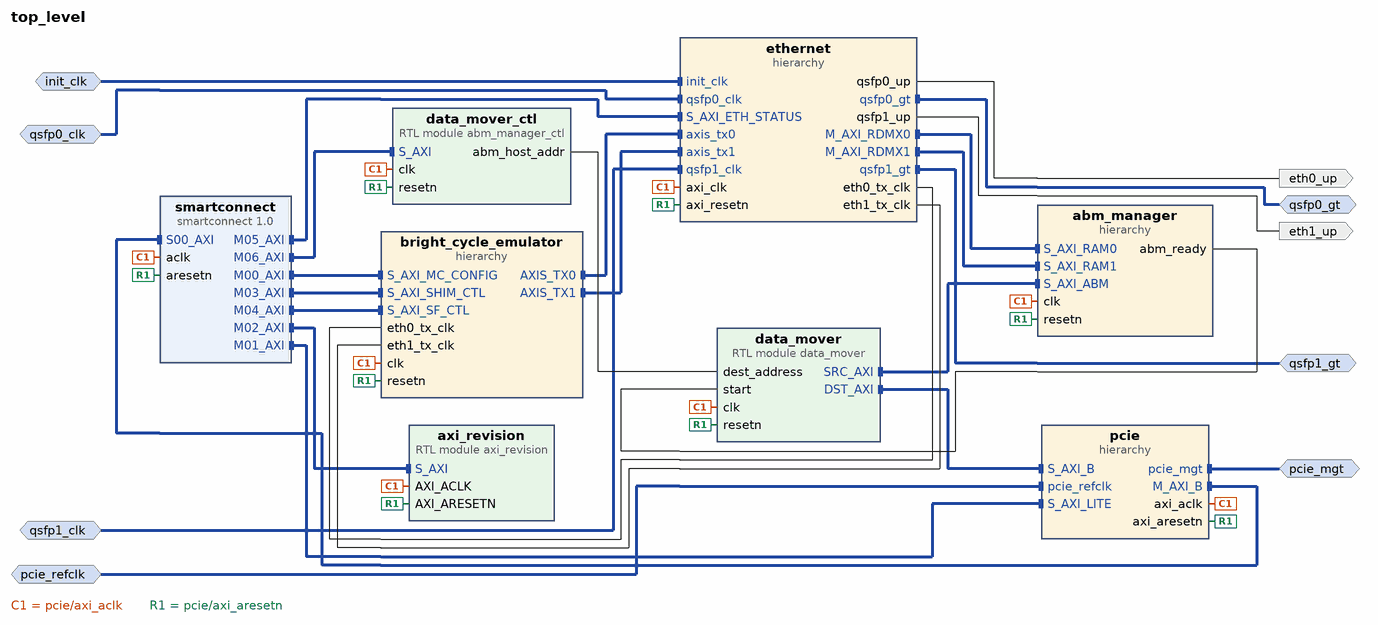
[diagram p0: block diagram of the top level]
# Vivado block design top_level, xczu19eg-ffvc1760-2-i, Vivado 2021.1
create_bd_design top_level

create_bd_intf_port -mode Slave -vlnv xilinx.com:interface:diff_clock_rtl:1.0 pcie_refclk
create_bd_intf_port -mode Master -vlnv xilinx.com:interface:pcie_7x_mgt_rtl:1.0 pcie_mgt
create_bd_intf_port -mode Slave -vlnv xilinx.com:interface:diff_clock_rtl:1.0 qsfp0_clk
set_property -dict {CONFIG.FREQ_HZ 322265625} [get_bd_intf_ports qsfp0_clk]
create_bd_intf_port -mode Master -vlnv xilinx.com:interface:gt_rtl:1.0 qsfp0_gt
create_bd_intf_port -mode Master -vlnv xilinx.com:interface:gt_rtl:1.0 qsfp1_gt
create_bd_intf_port -mode Slave -vlnv xilinx.com:interface:diff_clock_rtl:1.0 qsfp1_clk
set_property -dict {CONFIG.FREQ_HZ 322265625} [get_bd_intf_ports qsfp1_clk]
create_bd_intf_port -mode Slave -vlnv xilinx.com:interface:diff_clock_rtl:1.0 init_clk
create_bd_port -dir O eth0_up
create_bd_port -dir O eth1_up

create_bd_cell -type hier pcie
create_bd_cell -type hier bright_cycle_emulator
create_bd_cell -type hier ethernet
create_bd_cell -type hier abm_manager
create_bd_cell -type module -reference abm_manager_ctl data_mover_ctl
create_bd_cell -type module -reference data_mover data_mover
create_bd_cell -type ip -vlnv xilinx.com:ip:smartconnect:1.0 smartconnect
set_property -dict {CONFIG.NUM_CLKS 1 CONFIG.NUM_MI 7 CONFIG.NUM_SI 2} [get_bd_cells smartconnect]
create_bd_cell -type module -reference axi_revision axi_revision

# ---- hierarchy /pcie ----
current_bd_instance /pcie
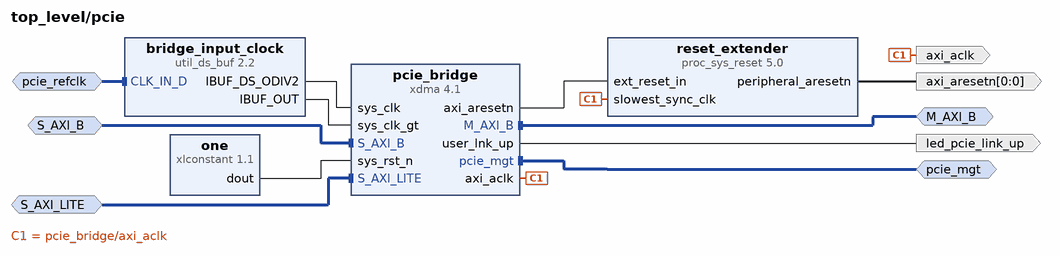
[diagram p1: block diagram inside /pcie]
create_bd_intf_pin -mode Master -vlnv xilinx.com:interface:aximm_rtl:1.0 M_AXI_B
create_bd_intf_pin -mode Slave -vlnv xilinx.com:interface:aximm_rtl:1.0 S_AXI_LITE
create_bd_intf_pin -mode Master -vlnv xilinx.com:interface:pcie_7x_mgt_rtl:1.0 pcie_mgt
create_bd_intf_pin -mode Slave -vlnv xilinx.com:interface:diff_clock_rtl:1.0 pcie_refclk
create_bd_intf_pin -mode Slave -vlnv xilinx.com:interface:aximm_rtl:1.0 S_AXI_B
create_bd_pin -dir O led_pcie_link_up
create_bd_pin -dir O -type clk axi_aclk
create_bd_pin -dir O -from 0 -to 0 -type rst axi_aresetn

create_bd_cell -type ip -vlnv xilinx.com:ip:proc_sys_reset:5.0 reset_extender
create_bd_cell -type ip -vlnv xilinx.com:ip:util_ds_buf:2.2 bridge_input_clock
set_property -dict {CONFIG.C_BUF_TYPE IBUFDSGTE} [get_bd_cells bridge_input_clock]
create_bd_cell -type ip -vlnv xilinx.com:ip:xdma:4.1 pcie_bridge
set_property -dict [list \
  CONFIG.PF0_DEVICE_ID_mqdma 903F \
  CONFIG.PF0_SRIOV_VF_DEVICE_ID A03F \
  CONFIG.PF2_DEVICE_ID_mqdma 923F \
  CONFIG.PF3_DEVICE_ID_mqdma 933F \
  CONFIG.axi_addr_width 64 \
  CONFIG.axi_data_width 512_bit \
  CONFIG.axisten_freq 250 \
  CONFIG.bridge_burst true \
  CONFIG.dma_reset_source_sel User_Reset \
  CONFIG.en_axi_slave_if true \
  CONFIG.enable_jtag_dbg false \
  CONFIG.functional_mode AXI_Bridge \
  CONFIG.mode_selection Advanced \
  CONFIG.pcie_blk_locn X1Y0 \
  CONFIG.pf0_bar0_scale Megabytes \
  CONFIG.pf0_bar0_size 1 \
  CONFIG.pf0_device_id 903F \
  CONFIG.pl_link_cap_max_link_speed 8.0_GT/s \
  CONFIG.pl_link_cap_max_link_width X16 \
  CONFIG.plltype QPLL1 \
] [get_bd_cells pcie_bridge]
create_bd_cell -type ip -vlnv xilinx.com:ip:xlconstant:1.1 one

# ---- hierarchy /bright_cycle_emulator ----
current_bd_instance /bright_cycle_emulator
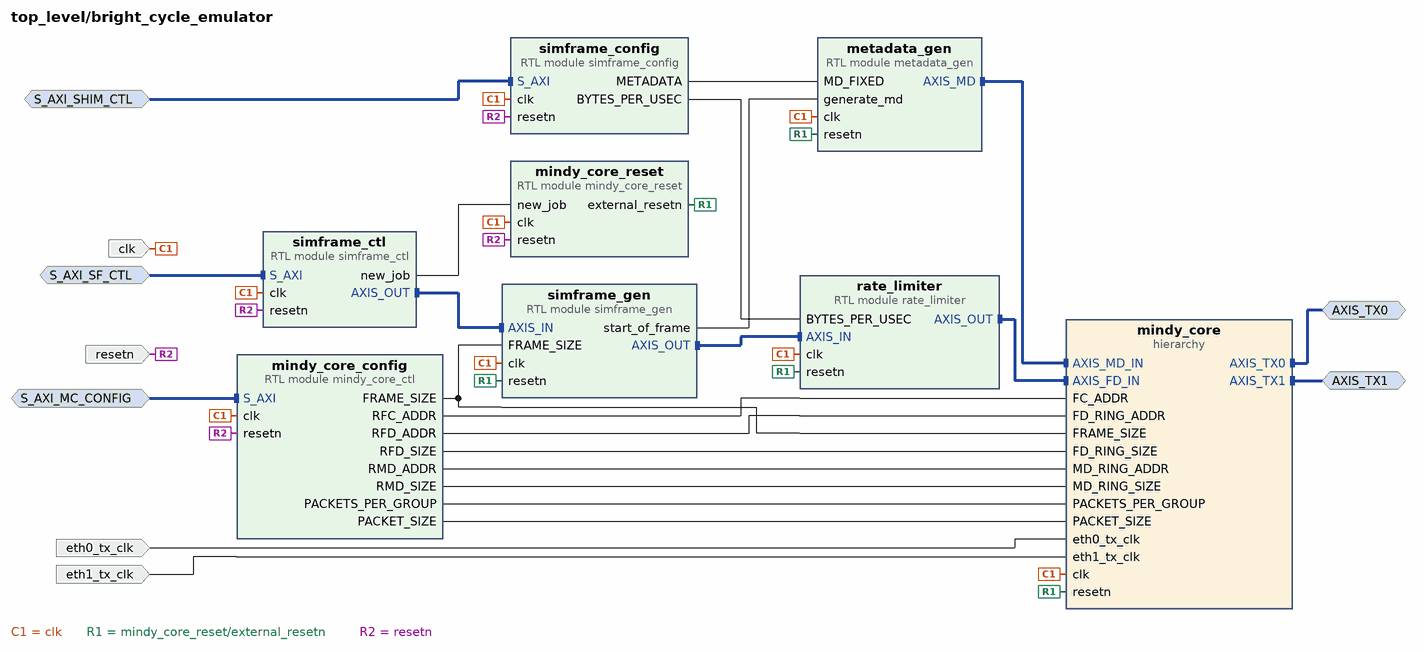
[diagram p2: block diagram inside /bright_cycle_emulator]
create_bd_intf_pin -mode Slave -vlnv xilinx.com:interface:aximm_rtl:1.0 S_AXI_MC_CONFIG
create_bd_intf_pin -mode Slave -vlnv xilinx.com:interface:aximm_rtl:1.0 S_AXI_SF_CTL
create_bd_intf_pin -mode Slave -vlnv xilinx.com:interface:aximm_rtl:1.0 S_AXI_SHIM_CTL
create_bd_intf_pin -mode Master -vlnv xilinx.com:interface:axis_rtl:1.0 AXIS_TX0
create_bd_intf_pin -mode Master -vlnv xilinx.com:interface:axis_rtl:1.0 AXIS_TX1
create_bd_pin -dir I clk
create_bd_pin -dir I resetn
create_bd_pin -dir I eth0_tx_clk
create_bd_pin -dir I eth1_tx_clk

create_bd_cell -type hier mindy_core
create_bd_cell -type module -reference metadata_gen metadata_gen
create_bd_cell -type module -reference mindy_core_ctl mindy_core_config
create_bd_cell -type module -reference mindy_core_reset mindy_core_reset
create_bd_cell -type module -reference rate_limiter rate_limiter
create_bd_cell -type module -reference simframe_config simframe_config
create_bd_cell -type module -reference simframe_gen simframe_gen
create_bd_cell -type module -reference simframe_ctl simframe_ctl

# ---- hierarchy /bright_cycle_emulator/mindy_core ----
current_bd_instance /bright_cycle_emulator/mindy_core
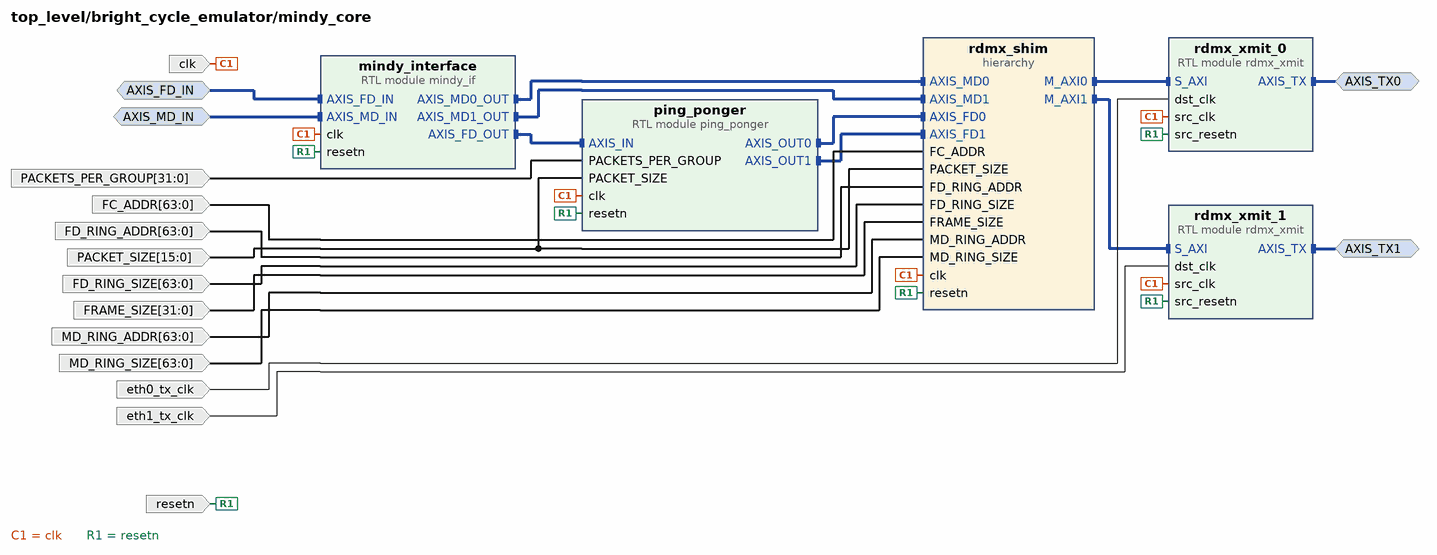
[diagram p3: block diagram inside /bright_cycle_emulator/mindy_core]
create_bd_intf_pin -mode Slave -vlnv xilinx.com:interface:axis_rtl:1.0 AXIS_FD_IN
create_bd_intf_pin -mode Slave -vlnv xilinx.com:interface:axis_rtl:1.0 AXIS_MD_IN
create_bd_intf_pin -mode Master -vlnv xilinx.com:interface:axis_rtl:1.0 AXIS_TX0
create_bd_intf_pin -mode Master -vlnv xilinx.com:interface:axis_rtl:1.0 AXIS_TX1
create_bd_pin -dir I clk
create_bd_pin -dir I resetn
create_bd_pin -dir I -from 15 -to 0 PACKET_SIZE
create_bd_pin -dir I -from 31 -to 0 PACKETS_PER_GROUP
create_bd_pin -dir I -from 31 -to 0 FRAME_SIZE
create_bd_pin -dir I -from 63 -to 0 FD_RING_ADDR
create_bd_pin -dir I -from 63 -to 0 FD_RING_SIZE
create_bd_pin -dir I -from 63 -to 0 MD_RING_ADDR
create_bd_pin -dir I -from 63 -to 0 MD_RING_SIZE
create_bd_pin -dir I -from 63 -to 0 FC_ADDR
create_bd_pin -dir I eth0_tx_clk
create_bd_pin -dir I eth1_tx_clk

create_bd_cell -type hier rdmx_shim
create_bd_cell -type module -reference mindy_if mindy_interface
create_bd_cell -type module -reference ping_ponger ping_ponger
create_bd_cell -type module -reference rdmx_xmit rdmx_xmit_0
set_property -dict {CONFIG.SRC_MAC 0} [get_bd_cells rdmx_xmit_0]
create_bd_cell -type module -reference rdmx_xmit rdmx_xmit_1
set_property -dict {CONFIG.SRC_MAC 1} [get_bd_cells rdmx_xmit_1]

# ---- hierarchy /bright_cycle_emulator/mindy_core/rdmx_shim ----
current_bd_instance /bright_cycle_emulator/mindy_core/rdmx_shim
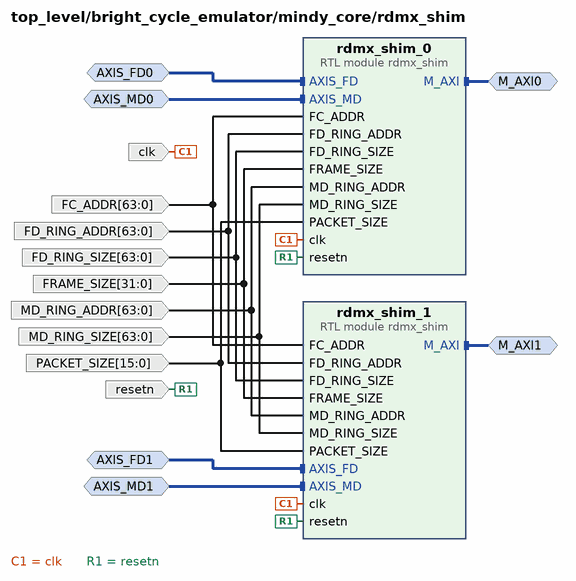
[diagram p4: block diagram inside /bright_cycle_emulator/mindy_core/rdmx_shim]
create_bd_intf_pin -mode Slave -vlnv xilinx.com:interface:axis_rtl:1.0 AXIS_FD0
create_bd_intf_pin -mode Slave -vlnv xilinx.com:interface:axis_rtl:1.0 AXIS_MD0
create_bd_intf_pin -mode Slave -vlnv xilinx.com:interface:axis_rtl:1.0 AXIS_FD1
create_bd_intf_pin -mode Slave -vlnv xilinx.com:interface:axis_rtl:1.0 AXIS_MD1
create_bd_intf_pin -mode Master -vlnv xilinx.com:interface:aximm_rtl:1.0 M_AXI0
create_bd_intf_pin -mode Master -vlnv xilinx.com:interface:aximm_rtl:1.0 M_AXI1
create_bd_pin -dir I clk
create_bd_pin -dir I resetn
create_bd_pin -dir I -from 15 -to 0 PACKET_SIZE
create_bd_pin -dir I -from 31 -to 0 FRAME_SIZE
create_bd_pin -dir I -from 63 -to 0 FD_RING_ADDR
create_bd_pin -dir I -from 63 -to 0 FD_RING_SIZE
create_bd_pin -dir I -from 63 -to 0 MD_RING_ADDR
create_bd_pin -dir I -from 63 -to 0 MD_RING_SIZE
create_bd_pin -dir I -from 63 -to 0 FC_ADDR

create_bd_cell -type module -reference rdmx_shim rdmx_shim_0
create_bd_cell -type module -reference rdmx_shim rdmx_shim_1

# ---- hierarchy /ethernet ----
current_bd_instance /ethernet
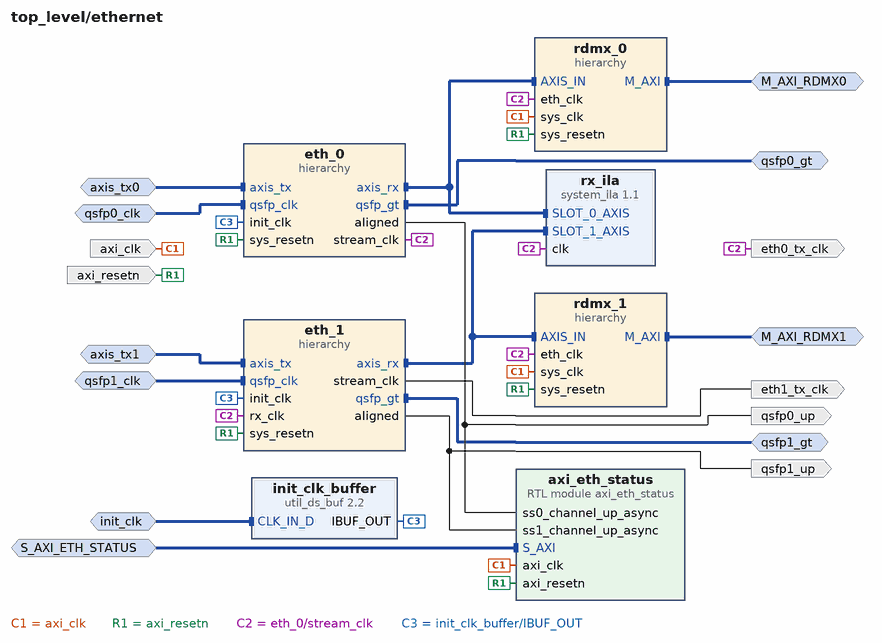
[diagram p5: block diagram inside /ethernet]
create_bd_intf_pin -mode Master -vlnv xilinx.com:interface:gt_rtl:1.0 qsfp1_gt
create_bd_intf_pin -mode Slave -vlnv xilinx.com:interface:diff_clock_rtl:1.0 qsfp1_clk
create_bd_intf_pin -mode Slave -vlnv xilinx.com:interface:axis_rtl:1.0 axis_tx1
create_bd_intf_pin -mode Master -vlnv xilinx.com:interface:gt_rtl:1.0 qsfp0_gt
create_bd_intf_pin -mode Slave -vlnv xilinx.com:interface:diff_clock_rtl:1.0 qsfp0_clk
create_bd_intf_pin -mode Slave -vlnv xilinx.com:interface:axis_rtl:1.0 axis_tx0
create_bd_intf_pin -mode Slave -vlnv xilinx.com:interface:aximm_rtl:1.0 S_AXI_ETH_STATUS
create_bd_intf_pin -mode Master -vlnv xilinx.com:interface:aximm_rtl:1.0 M_AXI_RDMX0
create_bd_intf_pin -mode Master -vlnv xilinx.com:interface:aximm_rtl:1.0 M_AXI_RDMX1
create_bd_intf_pin -mode Slave -vlnv xilinx.com:interface:diff_clock_rtl:1.0 init_clk
create_bd_pin -dir O -type clk eth1_tx_clk
create_bd_pin -dir O qsfp1_up
create_bd_pin -dir O -type clk eth0_tx_clk
create_bd_pin -dir O qsfp0_up
create_bd_pin -dir I axi_clk
create_bd_pin -dir I axi_resetn

create_bd_cell -type hier eth_1
create_bd_cell -type hier eth_0
create_bd_cell -type hier rdmx_0
create_bd_cell -type hier rdmx_1
create_bd_cell -type module -reference axi_eth_status axi_eth_status
create_bd_cell -type ip -vlnv xilinx.com:ip:system_ila:1.1 rx_ila
set_property -dict [list \
  CONFIG.C_MON_TYPE INTERFACE \
  CONFIG.C_NUM_MONITOR_SLOTS 2 \
  CONFIG.C_SLOT 1 \
  CONFIG.C_SLOT_0_INTF_TYPE xilinx.com:interface:axis_rtl:1.0 \
  CONFIG.C_SLOT_1_INTF_TYPE xilinx.com:interface:axis_rtl:1.0 \
] [get_bd_cells rx_ila]
create_bd_cell -type ip -vlnv xilinx.com:ip:util_ds_buf:2.2 init_clk_buffer

# ---- hierarchy /ethernet/eth_1 ----
current_bd_instance /ethernet/eth_1
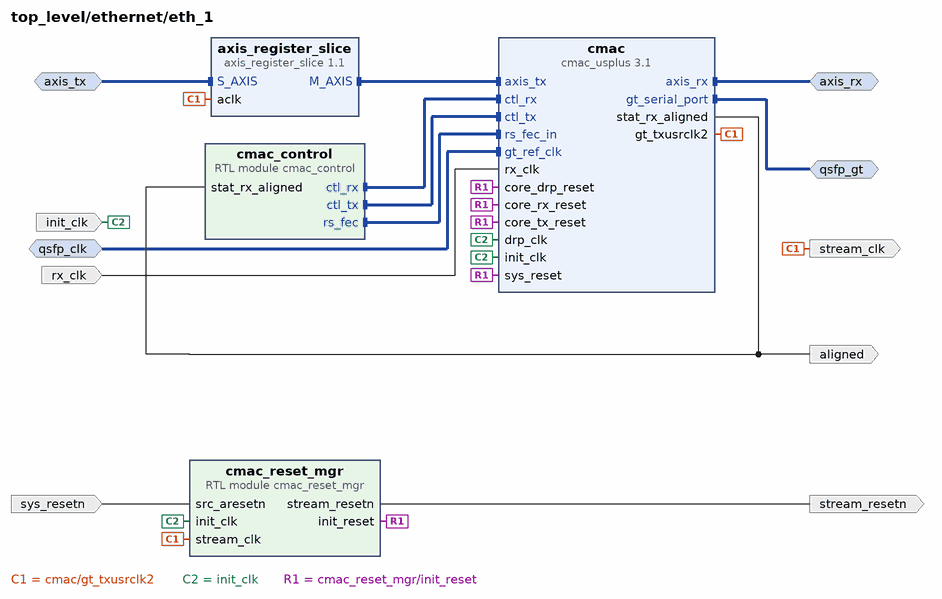
[diagram p6: block diagram inside /ethernet/eth_1]
create_bd_intf_pin -mode Master -vlnv xilinx.com:interface:gt_rtl:1.0 qsfp_gt
create_bd_intf_pin -mode Slave -vlnv xilinx.com:interface:diff_clock_rtl:1.0 qsfp_clk
create_bd_intf_pin -mode Slave -vlnv xilinx.com:interface:axis_rtl:1.0 axis_tx
create_bd_intf_pin -mode Master -vlnv xilinx.com:interface:axis_rtl:1.0 axis_rx
create_bd_pin -dir I -type rst sys_resetn
create_bd_pin -dir O -type clk stream_clk
create_bd_pin -dir O -type rst stream_resetn
create_bd_pin -dir O aligned
create_bd_pin -dir I -type clk rx_clk
create_bd_pin -dir I init_clk

create_bd_cell -type ip -vlnv xilinx.com:ip:axis_register_slice:1.1 axis_register_slice
create_bd_cell -type ip -vlnv xilinx.com:ip:cmac_usplus:3.1 cmac
set_property -dict [list \
  CONFIG.CMAC_CAUI4_MODE 1 \
  CONFIG.CMAC_CORE_SELECT CMACE4_X0Y2 \
  CONFIG.GT_DRP_CLK 100 \
  CONFIG.GT_GROUP_SELECT {X0Y16~X0Y19} \
  CONFIG.GT_REF_CLK_FREQ 322.265625 \
  CONFIG.INCLUDE_RS_FEC 1 \
  CONFIG.NUM_LANES 4x25 \
  CONFIG.RX_FLOW_CONTROL 0 \
  CONFIG.TX_FLOW_CONTROL 0 \
  CONFIG.USER_INTERFACE AXIS \
] [get_bd_cells cmac]
create_bd_cell -type module -reference cmac_control cmac_control
create_bd_cell -type module -reference cmac_reset_mgr cmac_reset_mgr

# ---- hierarchy /ethernet/eth_0 ----
current_bd_instance /ethernet/eth_0
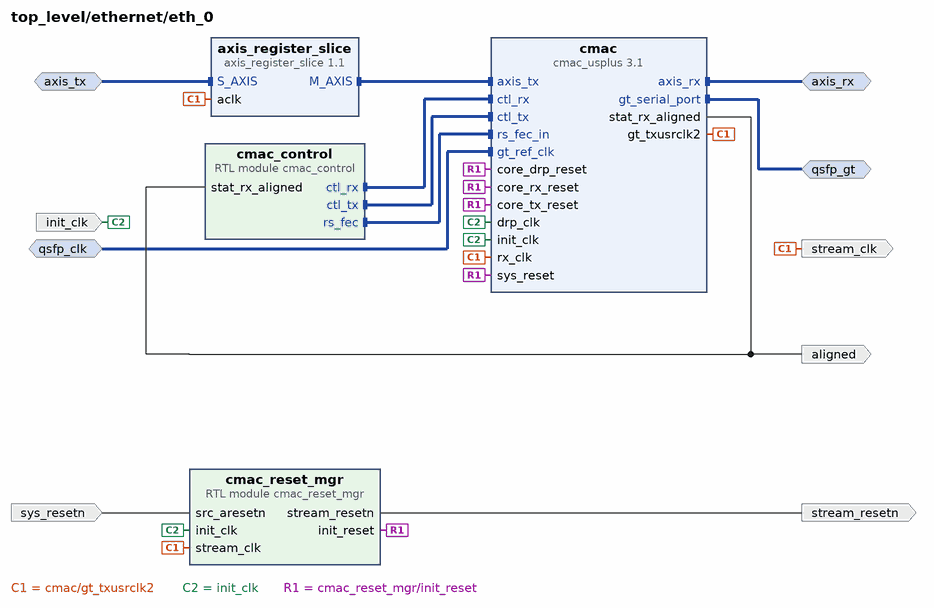
[diagram p7: block diagram inside /ethernet/eth_0]
create_bd_intf_pin -mode Master -vlnv xilinx.com:interface:gt_rtl:1.0 qsfp_gt
create_bd_intf_pin -mode Slave -vlnv xilinx.com:interface:diff_clock_rtl:1.0 qsfp_clk
create_bd_intf_pin -mode Slave -vlnv xilinx.com:interface:axis_rtl:1.0 axis_tx
create_bd_intf_pin -mode Master -vlnv xilinx.com:interface:axis_rtl:1.0 axis_rx
create_bd_pin -dir I -type rst sys_resetn
create_bd_pin -dir O -type clk stream_clk
create_bd_pin -dir O -type rst stream_resetn
create_bd_pin -dir O aligned
create_bd_pin -dir I -type clk init_clk

create_bd_cell -type ip -vlnv xilinx.com:ip:axis_register_slice:1.1 axis_register_slice
create_bd_cell -type module -reference cmac_control cmac_control
create_bd_cell -type module -reference cmac_reset_mgr cmac_reset_mgr
create_bd_cell -type ip -vlnv xilinx.com:ip:cmac_usplus:3.1 cmac
set_property -dict [list \
  CONFIG.CMAC_CAUI4_MODE 1 \
  CONFIG.CMAC_CORE_SELECT CMACE4_X0Y1 \
  CONFIG.GT_DRP_CLK 100 \
  CONFIG.GT_GROUP_SELECT {X0Y12~X0Y15} \
  CONFIG.GT_REF_CLK_FREQ 322.265625 \
  CONFIG.INCLUDE_RS_FEC 1 \
  CONFIG.NUM_LANES 4x25 \
  CONFIG.RX_FLOW_CONTROL 0 \
  CONFIG.TX_FLOW_CONTROL 0 \
  CONFIG.USER_INTERFACE AXIS \
] [get_bd_cells cmac]

# ---- hierarchy /ethernet/rdmx_0 ----
current_bd_instance /ethernet/rdmx_0
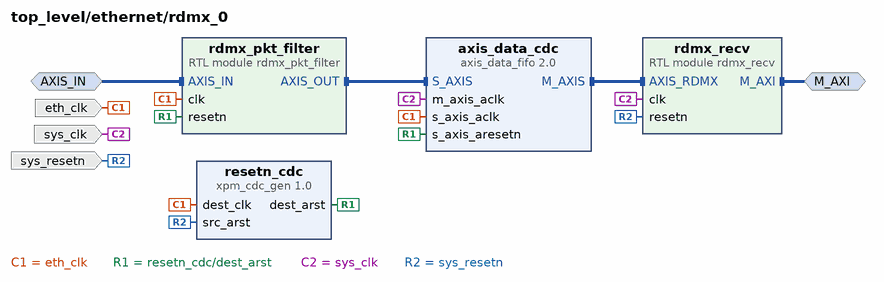
[diagram p8: block diagram inside /ethernet/rdmx_0]
create_bd_intf_pin -mode Slave -vlnv xilinx.com:interface:axis_rtl:1.0 AXIS_IN
create_bd_intf_pin -mode Master -vlnv xilinx.com:interface:aximm_rtl:1.0 M_AXI
create_bd_pin -dir I eth_clk
create_bd_pin -dir I sys_resetn
create_bd_pin -dir I sys_clk

create_bd_cell -type ip -vlnv xilinx.com:ip:axis_data_fifo:2.0 axis_data_cdc
set_property -dict {CONFIG.FIFO_DEPTH 16 CONFIG.IS_ACLK_ASYNC 1} [get_bd_cells axis_data_cdc]
create_bd_cell -type module -reference rdmx_pkt_filter rdmx_pkt_filter
create_bd_cell -type module -reference rdmx_recv rdmx_recv
create_bd_cell -type ip -vlnv xilinx.com:ip:xpm_cdc_gen:1.0 resetn_cdc
set_property -dict {CONFIG.CDC_TYPE xpm_cdc_async_rst CONFIG.RST_ACTIVE_HIGH false} [get_bd_cells resetn_cdc]

# ---- hierarchy /ethernet/rdmx_1 ----
current_bd_instance /ethernet/rdmx_1
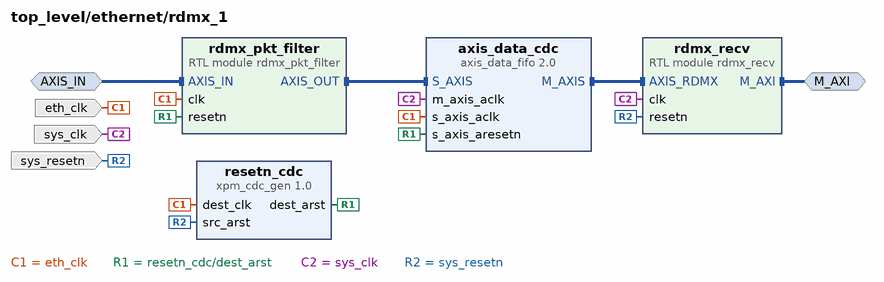
[diagram p9: block diagram inside /ethernet/rdmx_1]
create_bd_intf_pin -mode Slave -vlnv xilinx.com:interface:axis_rtl:1.0 AXIS_IN
create_bd_intf_pin -mode Master -vlnv xilinx.com:interface:aximm_rtl:1.0 M_AXI
create_bd_pin -dir I eth_clk
create_bd_pin -dir I sys_resetn
create_bd_pin -dir I sys_clk

create_bd_cell -type ip -vlnv xilinx.com:ip:axis_data_fifo:2.0 axis_data_cdc
set_property -dict {CONFIG.FIFO_DEPTH 16 CONFIG.IS_ACLK_ASYNC 1} [get_bd_cells axis_data_cdc]
create_bd_cell -type module -reference rdmx_pkt_filter rdmx_pkt_filter
create_bd_cell -type module -reference rdmx_recv rdmx_recv
create_bd_cell -type ip -vlnv xilinx.com:ip:xpm_cdc_gen:1.0 resetn_cdc
set_property -dict {CONFIG.CDC_TYPE xpm_cdc_async_rst CONFIG.RST_ACTIVE_HIGH false} [get_bd_cells resetn_cdc]

# ---- hierarchy /abm_manager ----
current_bd_instance /abm_manager
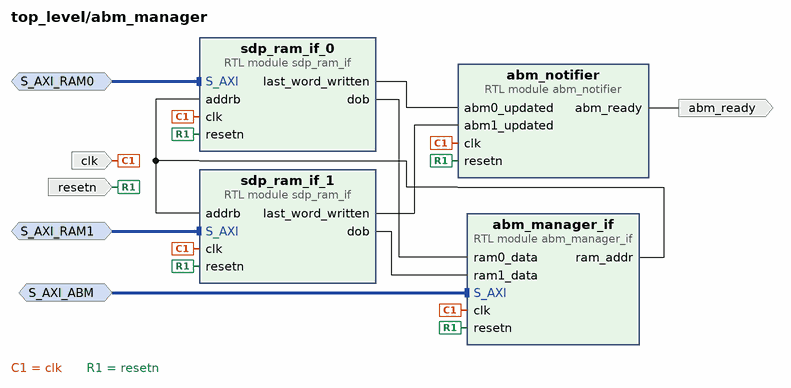
[diagram p10: block diagram inside /abm_manager]
create_bd_intf_pin -mode Slave -vlnv xilinx.com:interface:aximm_rtl:1.0 S_AXI_RAM1
create_bd_intf_pin -mode Slave -vlnv xilinx.com:interface:aximm_rtl:1.0 S_AXI_RAM0
create_bd_intf_pin -mode Slave -vlnv xilinx.com:interface:aximm_rtl:1.0 S_AXI_ABM
create_bd_pin -dir I clk
create_bd_pin -dir I resetn
create_bd_pin -dir O abm_ready

create_bd_cell -type module -reference abm_manager_if abm_manager_if
create_bd_cell -type module -reference abm_notifier abm_notifier
create_bd_cell -type module -reference sdp_ram_if sdp_ram_if_0
create_bd_cell -type module -reference sdp_ram_if sdp_ram_if_1

# ---- connections ----

current_bd_instance /pcie
connect_bd_intf_net [get_bd_intf_pins pcie_refclk] [get_bd_intf_pins bridge_input_clock/CLK_IN_D]
connect_bd_intf_net [get_bd_intf_pins S_AXI_B] [get_bd_intf_pins pcie_bridge/S_AXI_B]
connect_bd_intf_net [get_bd_intf_pins S_AXI_LITE] [get_bd_intf_pins pcie_bridge/S_AXI_LITE]
connect_bd_intf_net [get_bd_intf_pins M_AXI_B] [get_bd_intf_pins pcie_bridge/M_AXI_B]
connect_bd_intf_net [get_bd_intf_pins pcie_mgt] [get_bd_intf_pins pcie_bridge/pcie_mgt]
connect_bd_net [get_bd_pins bridge_input_clock/IBUF_DS_ODIV2] [get_bd_pins pcie_bridge/sys_clk]
connect_bd_net [get_bd_pins bridge_input_clock/IBUF_OUT] [get_bd_pins pcie_bridge/sys_clk_gt]
connect_bd_net [get_bd_pins one/dout] [get_bd_pins pcie_bridge/sys_rst_n]
connect_bd_net [get_bd_pins pcie_bridge/axi_aresetn] [get_bd_pins reset_extender/ext_reset_in]
connect_bd_net -net proc_sys_reset_0_peripheral_aresetn [get_bd_pins reset_extender/peripheral_aresetn] [get_bd_pins axi_aresetn]
connect_bd_net -net xdma_0_axi_aclk [get_bd_pins pcie_bridge/axi_aclk] [get_bd_pins axi_aclk] [get_bd_pins reset_extender/slowest_sync_clk]
connect_bd_net -net xdma_0_user_lnk_up [get_bd_pins pcie_bridge/user_lnk_up] [get_bd_pins led_pcie_link_up]

current_bd_instance /bright_cycle_emulator
connect_bd_intf_net [get_bd_intf_pins S_AXI_MC_CONFIG] [get_bd_intf_pins mindy_core_config/S_AXI]
connect_bd_intf_net [get_bd_intf_pins S_AXI_SF_CTL] [get_bd_intf_pins simframe_ctl/S_AXI]
connect_bd_intf_net [get_bd_intf_pins S_AXI_SHIM_CTL] [get_bd_intf_pins simframe_config/S_AXI]
connect_bd_intf_net [get_bd_intf_pins metadata_gen/AXIS_MD] [get_bd_intf_pins mindy_core/AXIS_MD_IN]
connect_bd_intf_net [get_bd_intf_pins AXIS_TX0] [get_bd_intf_pins mindy_core/AXIS_TX0]
connect_bd_intf_net [get_bd_intf_pins AXIS_TX1] [get_bd_intf_pins mindy_core/AXIS_TX1]
connect_bd_intf_net [get_bd_intf_pins rate_limiter/AXIS_OUT] [get_bd_intf_pins mindy_core/AXIS_FD_IN]
connect_bd_intf_net [get_bd_intf_pins simframe_ctl/AXIS_OUT] [get_bd_intf_pins simframe_gen/AXIS_IN]
connect_bd_intf_net [get_bd_intf_pins simframe_gen/AXIS_OUT] [get_bd_intf_pins rate_limiter/AXIS_IN]
connect_bd_net -net FC_ADDR_1 [get_bd_pins mindy_core_config/RFC_ADDR] [get_bd_pins mindy_core/FC_ADDR]
connect_bd_net -net FD_RING_ADDR_1 [get_bd_pins mindy_core_config/RFD_ADDR] [get_bd_pins mindy_core/FD_RING_ADDR]
connect_bd_net -net FD_RING_SIZE_1 [get_bd_pins mindy_core_config/RFD_SIZE] [get_bd_pins mindy_core/FD_RING_SIZE]
connect_bd_net -net MD_RING_ADDR_1 [get_bd_pins mindy_core_config/RMD_ADDR] [get_bd_pins mindy_core/MD_RING_ADDR]
connect_bd_net -net MD_RING_SIZE_1 [get_bd_pins mindy_core_config/RMD_SIZE] [get_bd_pins mindy_core/MD_RING_SIZE]
connect_bd_net -net PACKETS_PER_GROUP_1 [get_bd_pins mindy_core_config/PACKETS_PER_GROUP] [get_bd_pins mindy_core/PACKETS_PER_GROUP]
connect_bd_net -net PACKET_SIZE_1 [get_bd_pins mindy_core_config/PACKET_SIZE] [get_bd_pins mindy_core/PACKET_SIZE]
connect_bd_net [get_bd_pins clk] \
  [get_bd_pins mindy_core/clk] [get_bd_pins metadata_gen/clk] [get_bd_pins mindy_core_config/clk] \
  [get_bd_pins mindy_core_reset/clk] [get_bd_pins rate_limiter/clk] [get_bd_pins simframe_config/clk] \
  [get_bd_pins simframe_gen/clk] [get_bd_pins simframe_ctl/clk]
connect_bd_net [get_bd_pins eth0_tx_clk] [get_bd_pins mindy_core/eth0_tx_clk]
connect_bd_net [get_bd_pins eth1_tx_clk] [get_bd_pins mindy_core/eth1_tx_clk]
connect_bd_net [get_bd_pins mindy_core_config/FRAME_SIZE] [get_bd_pins mindy_core/FRAME_SIZE] [get_bd_pins simframe_gen/FRAME_SIZE]
connect_bd_net [get_bd_pins mindy_core_reset/external_resetn] \
  [get_bd_pins mindy_core/resetn] [get_bd_pins metadata_gen/resetn] [get_bd_pins rate_limiter/resetn] \
  [get_bd_pins simframe_gen/resetn]
connect_bd_net [get_bd_pins resetn] \
  [get_bd_pins mindy_core_config/resetn] [get_bd_pins mindy_core_reset/resetn] [get_bd_pins simframe_config/resetn] \
  [get_bd_pins simframe_ctl/resetn]
connect_bd_net [get_bd_pins simframe_config/BYTES_PER_USEC] [get_bd_pins rate_limiter/BYTES_PER_USEC]
connect_bd_net [get_bd_pins simframe_config/METADATA] [get_bd_pins metadata_gen/MD_FIXED]
connect_bd_net [get_bd_pins simframe_ctl/new_job] [get_bd_pins mindy_core_reset/new_job]
connect_bd_net [get_bd_pins simframe_gen/start_of_frame] [get_bd_pins metadata_gen/generate_md]

current_bd_instance /bright_cycle_emulator/mindy_core
connect_bd_intf_net [get_bd_intf_pins AXIS_FD_IN] [get_bd_intf_pins mindy_interface/AXIS_FD_IN]
connect_bd_intf_net [get_bd_intf_pins AXIS_MD_IN] [get_bd_intf_pins mindy_interface/AXIS_MD_IN]
connect_bd_intf_net [get_bd_intf_pins mindy_interface/AXIS_FD_OUT] [get_bd_intf_pins ping_ponger/AXIS_IN]
connect_bd_intf_net [get_bd_intf_pins mindy_interface/AXIS_MD0_OUT] [get_bd_intf_pins rdmx_shim/AXIS_MD0]
connect_bd_intf_net [get_bd_intf_pins mindy_interface/AXIS_MD1_OUT] [get_bd_intf_pins rdmx_shim/AXIS_MD1]
connect_bd_intf_net [get_bd_intf_pins ping_ponger/AXIS_OUT0] [get_bd_intf_pins rdmx_shim/AXIS_FD0]
connect_bd_intf_net [get_bd_intf_pins ping_ponger/AXIS_OUT1] [get_bd_intf_pins rdmx_shim/AXIS_FD1]
connect_bd_intf_net [get_bd_intf_pins rdmx_xmit_0/S_AXI] [get_bd_intf_pins rdmx_shim/M_AXI0]
connect_bd_intf_net [get_bd_intf_pins rdmx_xmit_1/S_AXI] [get_bd_intf_pins rdmx_shim/M_AXI1]
connect_bd_intf_net [get_bd_intf_pins AXIS_TX0] [get_bd_intf_pins rdmx_xmit_0/AXIS_TX]
connect_bd_intf_net [get_bd_intf_pins AXIS_TX1] [get_bd_intf_pins rdmx_xmit_1/AXIS_TX]
connect_bd_net [get_bd_pins FC_ADDR] [get_bd_pins rdmx_shim/FC_ADDR]
connect_bd_net [get_bd_pins FD_RING_ADDR] [get_bd_pins rdmx_shim/FD_RING_ADDR]
connect_bd_net [get_bd_pins FD_RING_SIZE] [get_bd_pins rdmx_shim/FD_RING_SIZE]
connect_bd_net [get_bd_pins FRAME_SIZE] [get_bd_pins rdmx_shim/FRAME_SIZE]
connect_bd_net [get_bd_pins MD_RING_ADDR] [get_bd_pins rdmx_shim/MD_RING_ADDR]
connect_bd_net [get_bd_pins MD_RING_SIZE] [get_bd_pins rdmx_shim/MD_RING_SIZE]
connect_bd_net [get_bd_pins PACKETS_PER_GROUP] [get_bd_pins ping_ponger/PACKETS_PER_GROUP]
connect_bd_net [get_bd_pins PACKET_SIZE] [get_bd_pins rdmx_shim/PACKET_SIZE] [get_bd_pins ping_ponger/PACKET_SIZE]
connect_bd_net [get_bd_pins clk] \
  [get_bd_pins rdmx_shim/clk] [get_bd_pins mindy_interface/clk] [get_bd_pins ping_ponger/clk] \
  [get_bd_pins rdmx_xmit_0/src_clk] [get_bd_pins rdmx_xmit_1/src_clk]
connect_bd_net [get_bd_pins eth0_tx_clk] [get_bd_pins rdmx_xmit_0/dst_clk]
connect_bd_net [get_bd_pins eth1_tx_clk] [get_bd_pins rdmx_xmit_1/dst_clk]
connect_bd_net [get_bd_pins resetn] \
  [get_bd_pins rdmx_shim/resetn] [get_bd_pins mindy_interface/resetn] [get_bd_pins ping_ponger/resetn] \
  [get_bd_pins rdmx_xmit_0/src_resetn] [get_bd_pins rdmx_xmit_1/src_resetn]

current_bd_instance /bright_cycle_emulator/mindy_core/rdmx_shim
connect_bd_intf_net [get_bd_intf_pins AXIS_FD1] [get_bd_intf_pins rdmx_shim_1/AXIS_FD]
connect_bd_intf_net [get_bd_intf_pins AXIS_FD0] [get_bd_intf_pins rdmx_shim_0/AXIS_FD]
connect_bd_intf_net [get_bd_intf_pins AXIS_MD1] [get_bd_intf_pins rdmx_shim_1/AXIS_MD]
connect_bd_intf_net [get_bd_intf_pins AXIS_MD0] [get_bd_intf_pins rdmx_shim_0/AXIS_MD]
connect_bd_intf_net [get_bd_intf_pins M_AXI0] [get_bd_intf_pins rdmx_shim_0/M_AXI]
connect_bd_intf_net [get_bd_intf_pins M_AXI1] [get_bd_intf_pins rdmx_shim_1/M_AXI]
connect_bd_net [get_bd_pins FC_ADDR] [get_bd_pins rdmx_shim_0/FC_ADDR] [get_bd_pins rdmx_shim_1/FC_ADDR]
connect_bd_net [get_bd_pins FD_RING_ADDR] [get_bd_pins rdmx_shim_0/FD_RING_ADDR] [get_bd_pins rdmx_shim_1/FD_RING_ADDR]
connect_bd_net [get_bd_pins FD_RING_SIZE] [get_bd_pins rdmx_shim_0/FD_RING_SIZE] [get_bd_pins rdmx_shim_1/FD_RING_SIZE]
connect_bd_net [get_bd_pins FRAME_SIZE] [get_bd_pins rdmx_shim_0/FRAME_SIZE] [get_bd_pins rdmx_shim_1/FRAME_SIZE]
connect_bd_net [get_bd_pins MD_RING_ADDR] [get_bd_pins rdmx_shim_0/MD_RING_ADDR] [get_bd_pins rdmx_shim_1/MD_RING_ADDR]
connect_bd_net [get_bd_pins MD_RING_SIZE] [get_bd_pins rdmx_shim_0/MD_RING_SIZE] [get_bd_pins rdmx_shim_1/MD_RING_SIZE]
connect_bd_net [get_bd_pins PACKET_SIZE] [get_bd_pins rdmx_shim_0/PACKET_SIZE] [get_bd_pins rdmx_shim_1/PACKET_SIZE]
connect_bd_net [get_bd_pins clk] [get_bd_pins rdmx_shim_0/clk] [get_bd_pins rdmx_shim_1/clk]
connect_bd_net [get_bd_pins resetn] [get_bd_pins rdmx_shim_0/resetn] [get_bd_pins rdmx_shim_1/resetn]

current_bd_instance /ethernet
connect_bd_intf_net [get_bd_intf_pins init_clk] [get_bd_intf_pins init_clk_buffer/CLK_IN_D]
connect_bd_intf_net [get_bd_intf_pins S_AXI_ETH_STATUS] [get_bd_intf_pins axi_eth_status/S_AXI]
connect_bd_intf_net [get_bd_intf_pins axis_tx0] [get_bd_intf_pins eth_0/axis_tx]
connect_bd_intf_net [get_bd_intf_pins axis_tx1] [get_bd_intf_pins eth_1/axis_tx]
connect_bd_intf_net [get_bd_intf_pins qsfp0_gt] [get_bd_intf_pins eth_0/qsfp_gt]
connect_bd_intf_net [get_bd_intf_pins rdmx_0/AXIS_IN] [get_bd_intf_pins eth_0/axis_rx]
connect_bd_intf_net [get_bd_intf_pins rdmx_0/AXIS_IN] [get_bd_intf_pins rx_ila/SLOT_0_AXIS]
connect_bd_intf_net [get_bd_intf_pins rdmx_1/AXIS_IN] [get_bd_intf_pins eth_1/axis_rx]
connect_bd_intf_net [get_bd_intf_pins rdmx_1/AXIS_IN] [get_bd_intf_pins rx_ila/SLOT_1_AXIS]
connect_bd_intf_net [get_bd_intf_pins qsfp1_gt] [get_bd_intf_pins eth_1/qsfp_gt]
connect_bd_intf_net [get_bd_intf_pins qsfp0_clk] [get_bd_intf_pins eth_0/qsfp_clk]
connect_bd_intf_net [get_bd_intf_pins qsfp1_clk] [get_bd_intf_pins eth_1/qsfp_clk]
connect_bd_intf_net [get_bd_intf_pins M_AXI_RDMX0] [get_bd_intf_pins rdmx_0/M_AXI]
connect_bd_intf_net [get_bd_intf_pins M_AXI_RDMX1] [get_bd_intf_pins rdmx_1/M_AXI]
connect_bd_net [get_bd_pins axi_clk] [get_bd_pins rdmx_0/sys_clk] [get_bd_pins rdmx_1/sys_clk] [get_bd_pins axi_eth_status/axi_clk]
connect_bd_net [get_bd_pins axi_resetn] \
  [get_bd_pins eth_0/sys_resetn] [get_bd_pins eth_1/sys_resetn] [get_bd_pins rdmx_0/sys_resetn] \
  [get_bd_pins rdmx_1/sys_resetn] [get_bd_pins axi_eth_status/axi_resetn]
connect_bd_net -net eth_0_stat_rx_aligned_0 [get_bd_pins eth_0/aligned] [get_bd_pins qsfp0_up] [get_bd_pins axi_eth_status/ss0_channel_up_async]
connect_bd_net [get_bd_pins eth_0/stream_clk] \
  [get_bd_pins eth0_tx_clk] [get_bd_pins eth_1/rx_clk] [get_bd_pins rdmx_0/eth_clk] [get_bd_pins rdmx_1/eth_clk] \
  [get_bd_pins rx_ila/clk]
connect_bd_net -net eth_1_stat_rx_aligned_0 [get_bd_pins eth_1/aligned] [get_bd_pins qsfp1_up] [get_bd_pins axi_eth_status/ss1_channel_up_async]
connect_bd_net [get_bd_pins eth_1/stream_clk] [get_bd_pins eth1_tx_clk]
connect_bd_net -net init_clk_0_1 [get_bd_pins init_clk_buffer/IBUF_OUT] [get_bd_pins eth_0/init_clk] [get_bd_pins eth_1/init_clk]

current_bd_instance /ethernet/eth_1
connect_bd_intf_net [get_bd_intf_pins axis_rx] [get_bd_intf_pins cmac/axis_rx]
connect_bd_intf_net [get_bd_intf_pins axis_register_slice/M_AXIS] [get_bd_intf_pins cmac/axis_tx]
connect_bd_intf_net [get_bd_intf_pins axis_tx] [get_bd_intf_pins axis_register_slice/S_AXIS]
connect_bd_intf_net [get_bd_intf_pins cmac_control/ctl_rx] [get_bd_intf_pins cmac/ctl_rx]
connect_bd_intf_net [get_bd_intf_pins cmac_control/ctl_tx] [get_bd_intf_pins cmac/ctl_tx]
connect_bd_intf_net [get_bd_intf_pins cmac_control/rs_fec] [get_bd_intf_pins cmac/rs_fec_in]
connect_bd_intf_net [get_bd_intf_pins qsfp_gt] [get_bd_intf_pins cmac/gt_serial_port]
connect_bd_intf_net [get_bd_intf_pins qsfp_clk] [get_bd_intf_pins cmac/gt_ref_clk]
connect_bd_net -net cmac_gt_rxusrclk2 [get_bd_pins cmac/gt_txusrclk2] \
  [get_bd_pins stream_clk] [get_bd_pins axis_register_slice/aclk] [get_bd_pins cmac_reset_mgr/stream_clk]
connect_bd_net -net cmac_reset_mgr_0_stream_resetn [get_bd_pins cmac_reset_mgr/stream_resetn] [get_bd_pins stream_resetn]
connect_bd_net [get_bd_pins cmac/stat_rx_aligned] [get_bd_pins aligned] [get_bd_pins cmac_control/stat_rx_aligned]
connect_bd_net [get_bd_pins init_clk] [get_bd_pins cmac/init_clk] [get_bd_pins cmac/drp_clk] [get_bd_pins cmac_reset_mgr/init_clk]
connect_bd_net -net init_clk_reset_peripheral_reset [get_bd_pins cmac_reset_mgr/init_reset] \
  [get_bd_pins cmac/sys_reset] [get_bd_pins cmac/core_rx_reset] [get_bd_pins cmac/core_tx_reset] \
  [get_bd_pins cmac/core_drp_reset]
connect_bd_net -net stream_clk1_1 [get_bd_pins rx_clk] [get_bd_pins cmac/rx_clk]
connect_bd_net -net sys_reset_1 [get_bd_pins sys_resetn] [get_bd_pins cmac_reset_mgr/src_aresetn]

current_bd_instance /ethernet/eth_0
connect_bd_intf_net [get_bd_intf_pins axis_rx] [get_bd_intf_pins cmac/axis_rx]
connect_bd_intf_net [get_bd_intf_pins axis_register_slice/M_AXIS] [get_bd_intf_pins cmac/axis_tx]
connect_bd_intf_net [get_bd_intf_pins axis_tx] [get_bd_intf_pins axis_register_slice/S_AXIS]
connect_bd_intf_net [get_bd_intf_pins cmac_control/ctl_rx] [get_bd_intf_pins cmac/ctl_rx]
connect_bd_intf_net [get_bd_intf_pins cmac_control/ctl_tx] [get_bd_intf_pins cmac/ctl_tx]
connect_bd_intf_net [get_bd_intf_pins cmac_control/rs_fec] [get_bd_intf_pins cmac/rs_fec_in]
connect_bd_intf_net [get_bd_intf_pins qsfp_gt] [get_bd_intf_pins cmac/gt_serial_port]
connect_bd_intf_net [get_bd_intf_pins qsfp_clk] [get_bd_intf_pins cmac/gt_ref_clk]
connect_bd_net -net cmac_gt_rxusrclk2 [get_bd_pins cmac/gt_txusrclk2] \
  [get_bd_pins stream_clk] [get_bd_pins axis_register_slice/aclk] [get_bd_pins cmac_reset_mgr/stream_clk] \
  [get_bd_pins cmac/rx_clk]
connect_bd_net -net cmac_reset_mgr_0_stream_resetn [get_bd_pins cmac_reset_mgr/stream_resetn] [get_bd_pins stream_resetn]
connect_bd_net [get_bd_pins cmac/stat_rx_aligned] [get_bd_pins aligned] [get_bd_pins cmac_control/stat_rx_aligned]
connect_bd_net -net init_clk_0_1 [get_bd_pins init_clk] [get_bd_pins cmac_reset_mgr/init_clk] [get_bd_pins cmac/init_clk] [get_bd_pins cmac/drp_clk]
connect_bd_net -net init_clk_reset_peripheral_reset [get_bd_pins cmac_reset_mgr/init_reset] \
  [get_bd_pins cmac/sys_reset] [get_bd_pins cmac/core_rx_reset] [get_bd_pins cmac/core_tx_reset] \
  [get_bd_pins cmac/core_drp_reset]
connect_bd_net -net sys_reset_1 [get_bd_pins sys_resetn] [get_bd_pins cmac_reset_mgr/src_aresetn]

current_bd_instance /ethernet/rdmx_0
connect_bd_intf_net [get_bd_intf_pins AXIS_IN] [get_bd_intf_pins rdmx_pkt_filter/AXIS_IN]
connect_bd_intf_net [get_bd_intf_pins axis_data_cdc/M_AXIS] [get_bd_intf_pins rdmx_recv/AXIS_RDMX]
connect_bd_intf_net [get_bd_intf_pins axis_data_cdc/S_AXIS] [get_bd_intf_pins rdmx_pkt_filter/AXIS_OUT]
connect_bd_intf_net [get_bd_intf_pins M_AXI] [get_bd_intf_pins rdmx_recv/M_AXI]
connect_bd_net -net clk_1 [get_bd_pins eth_clk] \
  [get_bd_pins axis_data_cdc/s_axis_aclk] [get_bd_pins rdmx_pkt_filter/clk] [get_bd_pins resetn_cdc/dest_clk]
connect_bd_net [get_bd_pins resetn_cdc/dest_arst] [get_bd_pins axis_data_cdc/s_axis_aresetn] [get_bd_pins rdmx_pkt_filter/resetn]
connect_bd_net [get_bd_pins sys_clk] [get_bd_pins axis_data_cdc/m_axis_aclk] [get_bd_pins rdmx_recv/clk]
connect_bd_net [get_bd_pins sys_resetn] [get_bd_pins rdmx_recv/resetn] [get_bd_pins resetn_cdc/src_arst]

current_bd_instance /ethernet/rdmx_1
connect_bd_intf_net [get_bd_intf_pins AXIS_IN] [get_bd_intf_pins rdmx_pkt_filter/AXIS_IN]
connect_bd_intf_net [get_bd_intf_pins axis_data_cdc/M_AXIS] [get_bd_intf_pins rdmx_recv/AXIS_RDMX]
connect_bd_intf_net [get_bd_intf_pins axis_data_cdc/S_AXIS] [get_bd_intf_pins rdmx_pkt_filter/AXIS_OUT]
connect_bd_intf_net [get_bd_intf_pins M_AXI] [get_bd_intf_pins rdmx_recv/M_AXI]
connect_bd_net -net clk_1 [get_bd_pins eth_clk] \
  [get_bd_pins axis_data_cdc/s_axis_aclk] [get_bd_pins rdmx_pkt_filter/clk] [get_bd_pins resetn_cdc/dest_clk]
connect_bd_net [get_bd_pins resetn_cdc/dest_arst] [get_bd_pins axis_data_cdc/s_axis_aresetn] [get_bd_pins rdmx_pkt_filter/resetn]
connect_bd_net [get_bd_pins sys_clk] [get_bd_pins axis_data_cdc/m_axis_aclk] [get_bd_pins rdmx_recv/clk]
connect_bd_net [get_bd_pins sys_resetn] [get_bd_pins rdmx_recv/resetn] [get_bd_pins resetn_cdc/src_arst]

current_bd_instance /abm_manager
connect_bd_intf_net [get_bd_intf_pins S_AXI_RAM0] [get_bd_intf_pins sdp_ram_if_0/S_AXI]
connect_bd_intf_net [get_bd_intf_pins S_AXI_ABM] [get_bd_intf_pins abm_manager_if/S_AXI]
connect_bd_intf_net [get_bd_intf_pins S_AXI_RAM1] [get_bd_intf_pins sdp_ram_if_1/S_AXI]
connect_bd_net [get_bd_pins abm_manager_if/ram_addr] [get_bd_pins sdp_ram_if_0/addrb] [get_bd_pins sdp_ram_if_1/addrb]
connect_bd_net [get_bd_pins abm_notifier/abm_ready] [get_bd_pins abm_ready]
connect_bd_net [get_bd_pins clk] \
  [get_bd_pins abm_manager_if/clk] [get_bd_pins abm_notifier/clk] [get_bd_pins sdp_ram_if_0/clk] \
  [get_bd_pins sdp_ram_if_1/clk]
connect_bd_net [get_bd_pins resetn] \
  [get_bd_pins abm_manager_if/resetn] [get_bd_pins abm_notifier/resetn] [get_bd_pins sdp_ram_if_0/resetn] \
  [get_bd_pins sdp_ram_if_1/resetn]
connect_bd_net [get_bd_pins sdp_ram_if_0/dob] [get_bd_pins abm_manager_if/ram0_data]
connect_bd_net [get_bd_pins sdp_ram_if_0/last_word_written] [get_bd_pins abm_notifier/abm0_updated]
connect_bd_net [get_bd_pins sdp_ram_if_1/dob] [get_bd_pins abm_manager_if/ram1_data]
connect_bd_net [get_bd_pins sdp_ram_if_1/last_word_written] [get_bd_pins abm_notifier/abm1_updated]

current_bd_instance /
connect_bd_intf_net [get_bd_intf_ports init_clk] [get_bd_intf_pins ethernet/init_clk]
connect_bd_intf_net [get_bd_intf_pins abm_manager/S_AXI_ABM] [get_bd_intf_pins data_mover/SRC_AXI]
connect_bd_intf_net [get_bd_intf_pins bright_cycle_emulator/AXIS_TX0] [get_bd_intf_pins ethernet/axis_tx0]
connect_bd_intf_net [get_bd_intf_pins bright_cycle_emulator/AXIS_TX1] [get_bd_intf_pins ethernet/axis_tx1]
connect_bd_intf_net [get_bd_intf_ports qsfp0_gt] [get_bd_intf_pins ethernet/qsfp0_gt]
connect_bd_intf_net [get_bd_intf_pins data_mover/DST_AXI] [get_bd_intf_pins pcie/S_AXI_B]
connect_bd_intf_net [get_bd_intf_ports qsfp1_gt] [get_bd_intf_pins ethernet/qsfp1_gt]
connect_bd_intf_net [get_bd_intf_pins ethernet/M_AXI_RDMX0] [get_bd_intf_pins abm_manager/S_AXI_RAM0]
connect_bd_intf_net [get_bd_intf_pins ethernet/M_AXI_RDMX1] [get_bd_intf_pins abm_manager/S_AXI_RAM1]
connect_bd_intf_net [get_bd_intf_ports qsfp0_clk] [get_bd_intf_pins ethernet/qsfp0_clk]
connect_bd_intf_net [get_bd_intf_ports pcie_refclk] [get_bd_intf_pins pcie/pcie_refclk]
connect_bd_intf_net [get_bd_intf_ports qsfp1_clk] [get_bd_intf_pins ethernet/qsfp1_clk]
connect_bd_intf_net [get_bd_intf_pins pcie/S_AXI_LITE] [get_bd_intf_pins smartconnect/M01_AXI]
connect_bd_intf_net [get_bd_intf_pins smartconnect/M00_AXI] [get_bd_intf_pins bright_cycle_emulator/S_AXI_MC_CONFIG]
connect_bd_intf_net [get_bd_intf_pins axi_revision/S_AXI] [get_bd_intf_pins smartconnect/M02_AXI]
connect_bd_intf_net [get_bd_intf_pins smartconnect/M03_AXI] [get_bd_intf_pins bright_cycle_emulator/S_AXI_SHIM_CTL]
connect_bd_intf_net [get_bd_intf_pins smartconnect/M04_AXI] [get_bd_intf_pins bright_cycle_emulator/S_AXI_SF_CTL]
connect_bd_intf_net [get_bd_intf_pins smartconnect/M05_AXI] [get_bd_intf_pins ethernet/S_AXI_ETH_STATUS]
connect_bd_intf_net [get_bd_intf_pins smartconnect/M06_AXI] [get_bd_intf_pins data_mover_ctl/S_AXI]
connect_bd_intf_net [get_bd_intf_pins pcie/M_AXI_B] [get_bd_intf_pins smartconnect/S00_AXI]
connect_bd_intf_net [get_bd_intf_ports pcie_mgt] [get_bd_intf_pins pcie/pcie_mgt]
connect_bd_net [get_bd_pins abm_manager/abm_ready] [get_bd_pins data_mover/start]
connect_bd_net -net abm_manager_ctl_0_abm_host_addr [get_bd_pins data_mover_ctl/abm_host_addr] [get_bd_pins data_mover/dest_address]
connect_bd_net -net eth_0_stream_clk [get_bd_pins ethernet/eth0_tx_clk] [get_bd_pins bright_cycle_emulator/eth0_tx_clk]
connect_bd_net -net eth_1_stream_clk [get_bd_pins ethernet/eth1_tx_clk] [get_bd_pins bright_cycle_emulator/eth1_tx_clk]
connect_bd_net [get_bd_pins ethernet/qsfp0_up] [get_bd_ports eth0_up]
connect_bd_net [get_bd_pins ethernet/qsfp1_up] [get_bd_ports eth1_up]
connect_bd_net -net source_200Mhz_clk [get_bd_pins pcie/axi_aclk] \
  [get_bd_pins bright_cycle_emulator/clk] [get_bd_pins ethernet/axi_clk] [get_bd_pins abm_manager/clk] \
  [get_bd_pins data_mover_ctl/clk] [get_bd_pins data_mover/clk] [get_bd_pins smartconnect/aclk] \
  [get_bd_pins axi_revision/AXI_ACLK]
connect_bd_net -net source_200Mhz_resetn [get_bd_pins pcie/axi_aresetn] \
  [get_bd_pins bright_cycle_emulator/resetn] [get_bd_pins ethernet/axi_resetn] [get_bd_pins abm_manager/resetn] \
  [get_bd_pins data_mover_ctl/resetn] [get_bd_pins data_mover/resetn] [get_bd_pins smartconnect/aresetn] \
  [get_bd_pins axi_revision/AXI_ARESETN]

# ---- address map ----
assign_bd_address -offset 0x0000000000000000 -range 16E -target_address_space [get_bd_addr_spaces bright_cycle_emulator/mindy_core/rdmx_shim/rdmx_shim_0/M_AXI] [get_bd_addr_segs bright_cycle_emulator/mindy_core/rdmx_xmit_0/S_AXI/reg0]
assign_bd_address -offset 0x0000000000000000 -range 16E -target_address_space [get_bd_addr_spaces bright_cycle_emulator/mindy_core/rdmx_shim/rdmx_shim_1/M_AXI] [get_bd_addr_segs bright_cycle_emulator/mindy_core/rdmx_xmit_1/S_AXI/reg0]
assign_bd_address -offset 0x0000000000000000 -range 16E -target_address_space [get_bd_addr_spaces data_mover/DST_AXI] [get_bd_addr_segs pcie/pcie_bridge/S_AXI_B/BAR0]
assign_bd_address -offset 0x0000000000000000 -range 1M -target_address_space [get_bd_addr_spaces data_mover/SRC_AXI] [get_bd_addr_segs abm_manager/abm_manager_if/S_AXI/reg0]
assign_bd_address -offset 0x0000000000000000 -range 1M -target_address_space [get_bd_addr_spaces ethernet/rdmx_0/rdmx_recv/M_AXI] [get_bd_addr_segs abm_manager/sdp_ram_if_0/S_AXI/reg0]
assign_bd_address -offset 0x0000000000000000 -range 1M -target_address_space [get_bd_addr_spaces ethernet/rdmx_1/rdmx_recv/M_AXI] [get_bd_addr_segs abm_manager/sdp_ram_if_1/S_AXI/reg0]
assign_bd_address -offset 0x0000000000000000 -range 256 -target_address_space [get_bd_addr_spaces pcie/pcie_bridge/M_AXI_B] [get_bd_addr_segs axi_revision/S_AXI/reg0]
assign_bd_address -offset 0x0000000000000500 -range 256 -target_address_space [get_bd_addr_spaces pcie/pcie_bridge/M_AXI_B] [get_bd_addr_segs ethernet/axi_eth_status/S_AXI/reg0]
assign_bd_address -offset 0x0000000000001000 -range 256 -target_address_space [get_bd_addr_spaces pcie/pcie_bridge/M_AXI_B] [get_bd_addr_segs bright_cycle_emulator/simframe_ctl/S_AXI/reg0]
assign_bd_address -offset 0x0000000000002000 -range 256 -target_address_space [get_bd_addr_spaces pcie/pcie_bridge/M_AXI_B] [get_bd_addr_segs bright_cycle_emulator/mindy_core_config/S_AXI/reg0]
assign_bd_address -offset 0x0000000000003000 -range 256 -target_address_space [get_bd_addr_spaces pcie/pcie_bridge/M_AXI_B] [get_bd_addr_segs bright_cycle_emulator/simframe_config/S_AXI/reg0]
assign_bd_address -offset 0x0000000000004000 -range 256 -target_address_space [get_bd_addr_spaces pcie/pcie_bridge/M_AXI_B] [get_bd_addr_segs data_mover_ctl/S_AXI/reg0]
assign_bd_address -offset 0x0000000100000000 -range 64K -target_address_space [get_bd_addr_spaces pcie/pcie_bridge/M_AXI_B] [get_bd_addr_segs pcie/pcie_bridge/S_AXI_LITE/CTL0]

validate_bd_design
save_bd_design
